# Altium schematic sheet LED.SchDoc
size A
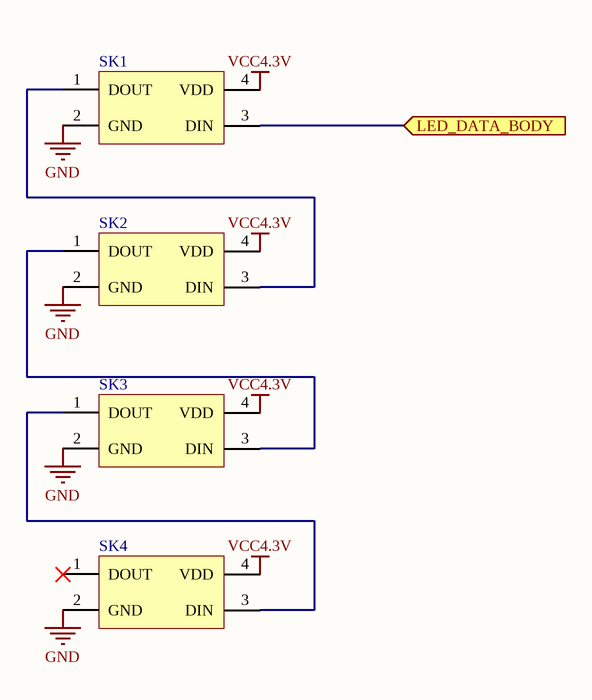
[diagram p0: LED.SchDoc]

## Parts
SK1  LED_3535_SK6812  [LED_3535_4P]  (value not drawn)
SK2  LED_3535_SK6812  [LED_3535_4P]  (value not drawn)
SK3  LED_3535_SK6812  [LED_3535_4P]  (value not drawn)
SK4  LED_3535_SK6812  [LED_3535_4P]  (value not drawn)

## Ports
LED_DATA_BODY (in)

## Nets
GND: SK1.2(GND) SK2.2(GND) SK3.2(GND) SK4.2(GND)
VCC4.3V: SK1.4(VDD) SK2.4(VDD) SK3.4(VDD) SK4.4(VDD)
LED_DATA_BODY: SK1.3(DIN) ; port LED_DATA_BODY
NetSK1_1: SK1.1(DOUT) SK2.3(DIN)
NetSK2_1: SK2.1(DOUT) SK3.3(DIN)
NetSK3_1: SK3.1(DOUT) SK4.3(DIN)

Not connected (* = marked no-connect by the designer): SK4 1(DOUT)*

## Library data of the parts
SK1-SK4 = LED_3535_SK6812: LED